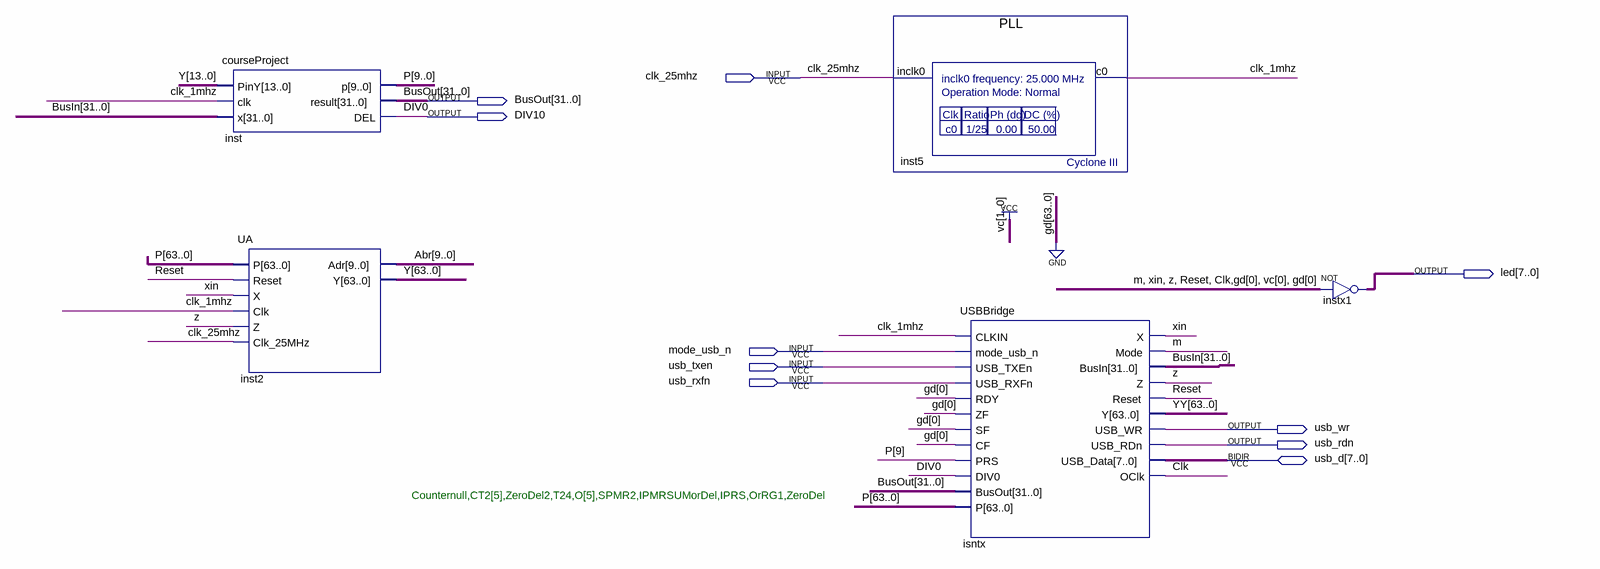
[diagram p0: schematic sheet]
// Quartus schematic Lab1Full.bdf as structural Verilog: 5 symbols, 10 pins
module Lab1Full (
  input  clk_25mhz,
  input  mode_usb_n,
  input  usb_txen,
  input  usb_rxfn,
  inout  [7:0] usb_d,
  output [31:0] BusOut,
  output DIV10,
  output [7:0] led,
  output usb_wr,
  output usb_rdn
);

  wire Clk, clk_1mhz, m, Reset, xin, z;
  wire [9:0] Abr;
  wire [31:0] BusIn;
  wire [63:0] P, Y, YY;

  courseProject inst (.PinY(Y[13:0]), .clk(clk_1mhz), .x(BusIn), .p(P[9:0]), .result(BusOut), .DEL(DIV10));
  UA inst2 (.P(P), .Reset(Reset), .X(xin), .Clk(clk_1mhz), .Z(z), .Clk_25MHz(clk_25mhz), .Adr(Abr), .Y(Y));
  PLL inst5 (.inclk0(clk_25mhz), .c0(clk_1mhz));
  USBBridge isntx (
    .CLKIN(clk_1mhz), .mode_usb_n(mode_usb_n), .USB_TXEn(usb_txen), .USB_RXFn(usb_rxfn), .RDY(1'b0),
    .ZF(1'b0), .SF(1'b0), .CF(1'b0), .PRS(P[9]), .DIV0(DIV10), .BusOut(BusOut), .P(P), .X(xin), .Mode(m),
    .BusIn(BusIn), .Z(z), .Reset(Reset), .Y(YY), .USB_WR(usb_wr), .USB_RDn(usb_rdn), .OClk(Clk),
    .USB_Data(usb_d));
  assign led = ~{m, xin, z, Reset, Clk, 3'b010};  // NOT instx1, 8 bits wide

  // Other names for the same wires on the sheet: DIV0 = DIV10

  // Notes on the sheet:
  //   Counternull,CT2[5],ZeroDel2,T24,O[5],SPMR2,IPMRSUMorDel,IPRS,OrRG1,ZeroDel
endmodule
